# EAGLE schematic display (EAGLE 6.6.0)
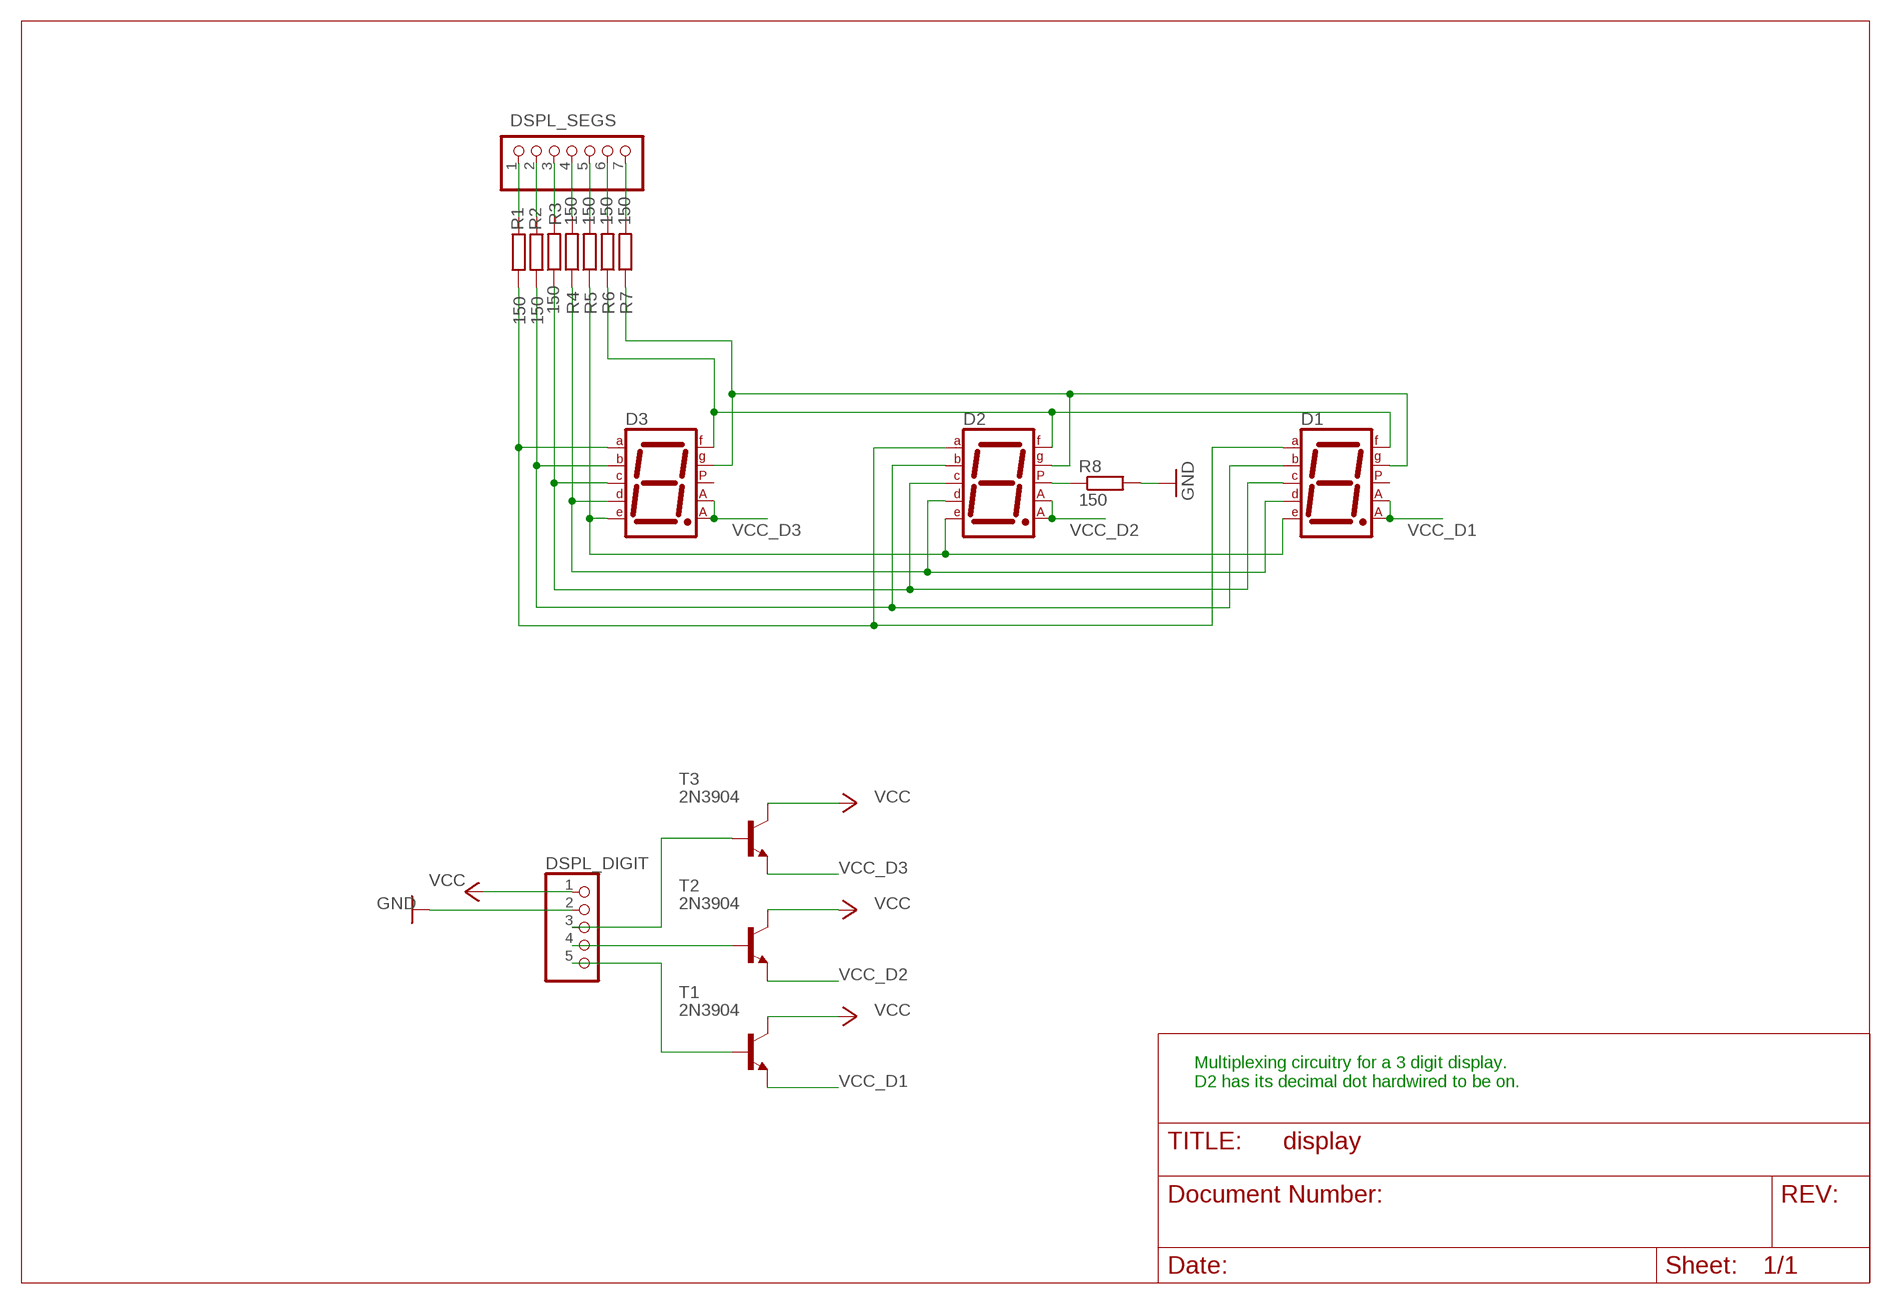
[diagram p0: schematic, sheet 1]

## Parts
D1  7SEG-CA  [7SEG-13]
D2  7SEG-CA  [7SEG-13]
D3  7SEG-CA  [7SEG-13]
DSPL_DIGIT  PINHD-1X5  [1X05]
DSPL_SEGS  PINHD-1X7  [1X07]
R1  150  R-EU_0204/7  [0204/7]
R2  150  R-EU_0204/7  [0204/7]
R3  150  R-EU_0204/7  [0204/7]
R4  150  R-EU_0204/7  [0204/7]
R5  150  R-EU_0204/7  [0204/7]
R6  150  R-EU_0204/7  [0204/7]
R7  150  R-EU_0204/7  [0204/7]
R8  150  R-EU_0204/7  [0204/7]
T1  2N3904  [TO92]
T2  2N3904  [TO92]
T3  2N3904  [TO92]

## Nets
GND: DSPL_DIGIT.2 R8.2
N$1: DSPL_DIGIT.5 T1.2(B)
N$2: D1.2(D) D2.2(D) D3.2(D) R4.1
N$3: D1.4(C) D2.4(C) D3.4(C) R3.1
N$4: D1.6(B) D2.6(B) D3.6(B) R2.2
N$5: D1.7(A) D2.7(A) D3.7(A) R1.2
N$9: DSPL_SEGS.1 R1.1
N$10: DSPL_SEGS.2 R2.1
N$11: D1.9(F) D2.9(F) D3.9(F) R6.1
N$12: D1.10(G) D2.10(G) D3.10(G) R7.1
N$13: D2.5(DP) R8.1
N$14: DSPL_SEGS.3 R3.2
N$15: DSPL_SEGS.4 R4.2
N$16: DSPL_SEGS.5 R5.2
N$17: DSPL_SEGS.6 R6.2
N$18: DSPL_SEGS.7 R7.2
N$19: D1.1(E) D2.1(E) D3.1(E) R5.1
N$20: DSPL_DIGIT.4 T2.2(B)
N$21: DSPL_DIGIT.3 T3.2(B)
VCC: DSPL_DIGIT.1 T1.1(C) T2.1(C) T3.1(C)
VCC_D1: D1.3(CA1) D1.8(CA2) T1.3(E)
VCC_D2: D2.3(CA1) D2.8(CA2) T2.3(E)
VCC_D3: D3.3(CA1) D3.8(CA2) T3.3(E)
Unconnected: D1.5(DP) D3.5(DP)

## Notes on the sheet
- Multiplexing circuitry for a 3 digit display.
  D2 has its decimal dot hardwired to be on.

## Library data of the parts
D1-D3 = special:7SEG-CA: 7-segment DISPLAY single anode, 13 mm
DSPL_DIGIT = pinhead:PINHD-1X5: PIN HEADER
DSPL_SEGS = pinhead:PINHD-1X7: PIN HEADER
R1-R8 = rcl:R-EU_: RESISTOR, European symbol
T1-T3 = transistor:2N3904: NPN TRANSISTOR